# EAGLE design SimpleEMGCircuit (EAGLE 7.3.0)
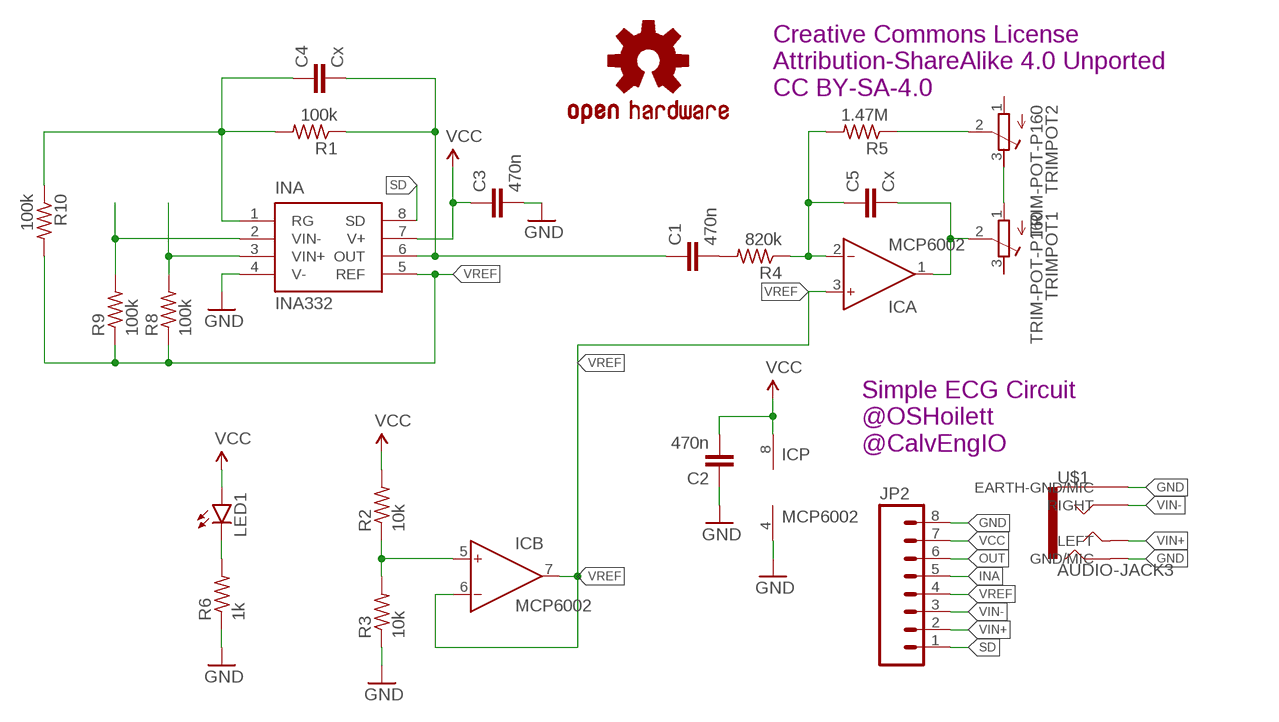
[diagram p0: schematic, sheet 1]

## Parts
C1  470n  C-EUC0402  [C0402]
C2  470n  C-EUC0402  [C0402]
C3  470n  C-EUC0402  [C0402]
C4  Cx  C-EUC0402  [C0402]
C5  Cx  C-EUC0402  [C0402]
IC  MCP6002  AD8607RM  [MSOP08]
INA  INA332  [MSOP08]
JP2  M08NO_SILK_FEMALE_PTH  [1X08_NO_SILK]
LED1  LED0603  [LED-0603]
LOGO1  OSHW-LOGOS  [OSHW-LOGO-S]
R1  100k  R-US_R0402  [R0402]
R2  10k  R-US_R0402  [R0402]
R3  10k  R-US_R0402  [R0402]
R4  820k  R-US_R0402  [R0402]
R5  1.47M  R-US_R0402  [R0402]
R6  1k  R-US_R0402  [R0402]
R8  100k  R-US_R0402  [R0402]
R9  100k  R-US_R0402  [R0402]
R10  100k  R-US_R0402  [R0402]
TRIMPOT1  TRIM-POT-P160  [16MMROTARYPOT]
TRIMPOT2  TRIM-POT-P160  [16MMROTARYPOT]
U$1  AUDIO-JACK3  [AUDIO-JACK-TRRS-SMD]

## Nets
GND: C2.1 C3.2 IC.4(P:V-) INA.4(V-) JP2.8 R3.1 R6.1 U$1.EARTH(EARTH-GND/MIC) U$1.RING2(GND/MIC)
INA: C1.1 C4.2 INA.6(OUT) JP2.5 R1.1
N$1: C4.1 INA.1(RG) R1.2 R10.1
N$2: TRIMPOT1.1(A) TRIMPOT2.3(E)
N$3: IC.5(B:IN+) R2.1 R3.2
N$4: C1.2 R4.2
N$5: C5.1 IC.2(A:IN-) R4.1 R5.2
N$6: LED1.C R6.2
N$14: R5.1 TRIMPOT2.2(S)
OUT: C5.2 IC.1(A:OUT) JP2.6 TRIMPOT1.2(S)
SD: INA.8(SD) JP2.1
VCC: C2.2 C3.1 IC.8(P:V+) INA.7(V+) JP2.7 LED1.A R2.2
VIN+: INA.3(VIN+) JP2.2 R8.2 U$1.TIP(LEFT)
VIN-: INA.2(VIN-) JP2.3 R9.2 U$1.RING1(RIGHT)
VREF: IC.3(A:IN+) IC.6(B:IN-) IC.7(B:OUT) INA.5(REF) JP2.4 R8.1 R9.1 R10.2
Unconnected: TRIMPOT1.3(E) TRIMPOT2.1(A)

## Notes on the sheet
- Creative Commons License
  Attribution-ShareAlike 4.0 Unported
  CC BY-SA-4.0
- Simple ECG Circuit
  @OSHoilett
  @CalvEngIO

## Library data of the parts
C1-C5 = resistor:C-EU: CAPACITOR, European symbol
IC = analog-devices:AD8607: Precision Micropower, Low Noise CMOS, Rail-to-Rail Input/Output Operational Amplifiers Source: http://www.analog.com/static/imported-files/data_sheets/AD8603_8607_8609.pdf; MF: ALTERA CORPORATION; MPN: AD8607ARMZ-REEL; OC_FARNELL: 1464990; OC_NEWARK: 59K6925
INA = Orlando:INA332
JP2 = SparkFun-Connectors:M08: Header 8 Standard 8-pin 0.1" header. Use with straight break away headers (SKU : PRT-00116), right angle break away headers (PRT-00553), swiss pins (PRT-00743), machine pins (PRT-00117), and female headers (PRT-00115).; PROD_ID: CONN-08438
LED1 = SparkFun-LED:LED: LEDs Standard schematic elements and footprints for 5mm, 3mm, 1206, and 0603 sized LEDs. 5mm - Spark Fun Electronics SKU : COM-00529 (and others)
LOGO1 = SparkFun-Aesthetics:OSHW-LOGO: Open Source Hardware Logo This logo indicates the piece of hardware it is found on incorporates a OSHW license and/or adheres to the definition of open source hardware found here: http://freedomdefined.org/OSHW
R1-R6 R8-R10 = resistor:R-US_: RESISTOR, American symbol
TRIMPOT1 TRIMPOT2 = Orlando:TRIM-POT-P160
U$1 = SparkFun-Connectors:AUDIO-JACK3: Audio jack - 3.5mm TRRS variety - two rings.

## Board
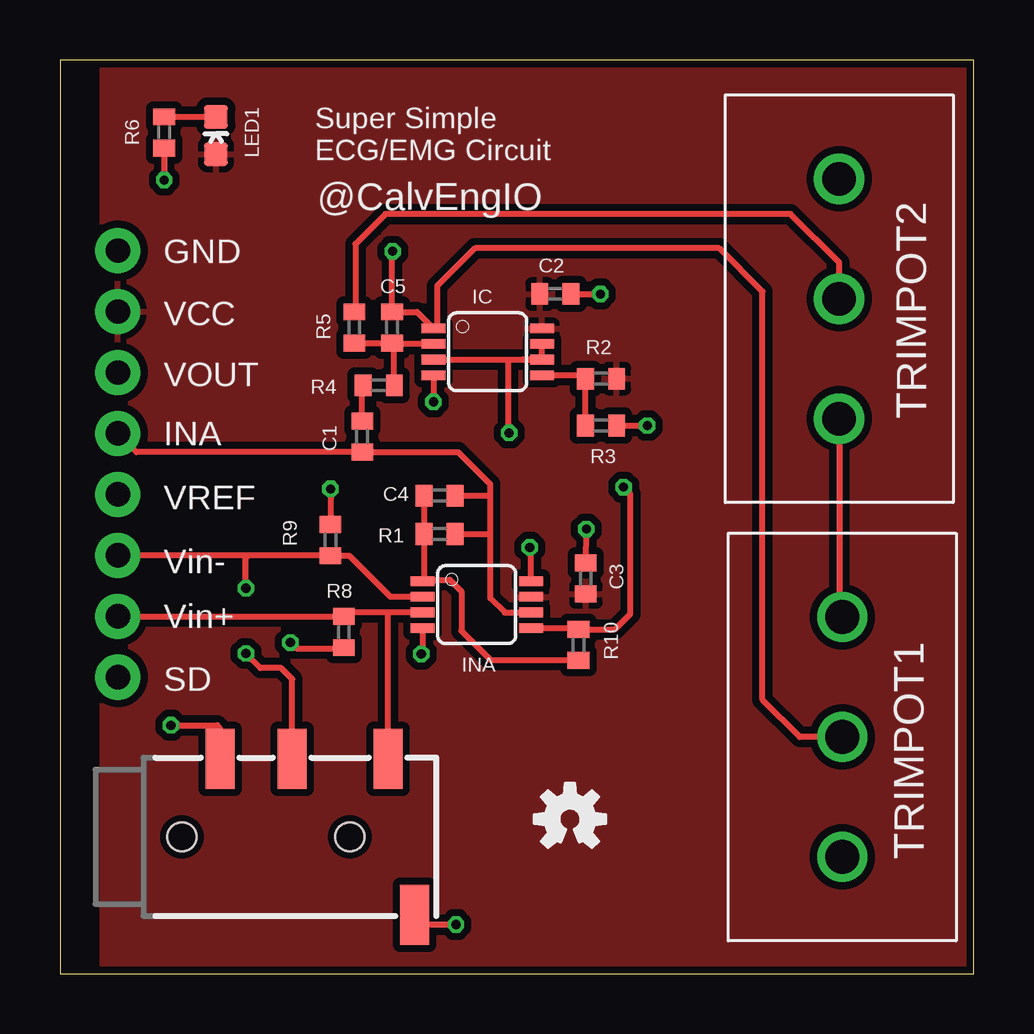
[diagram p1: board, top side]
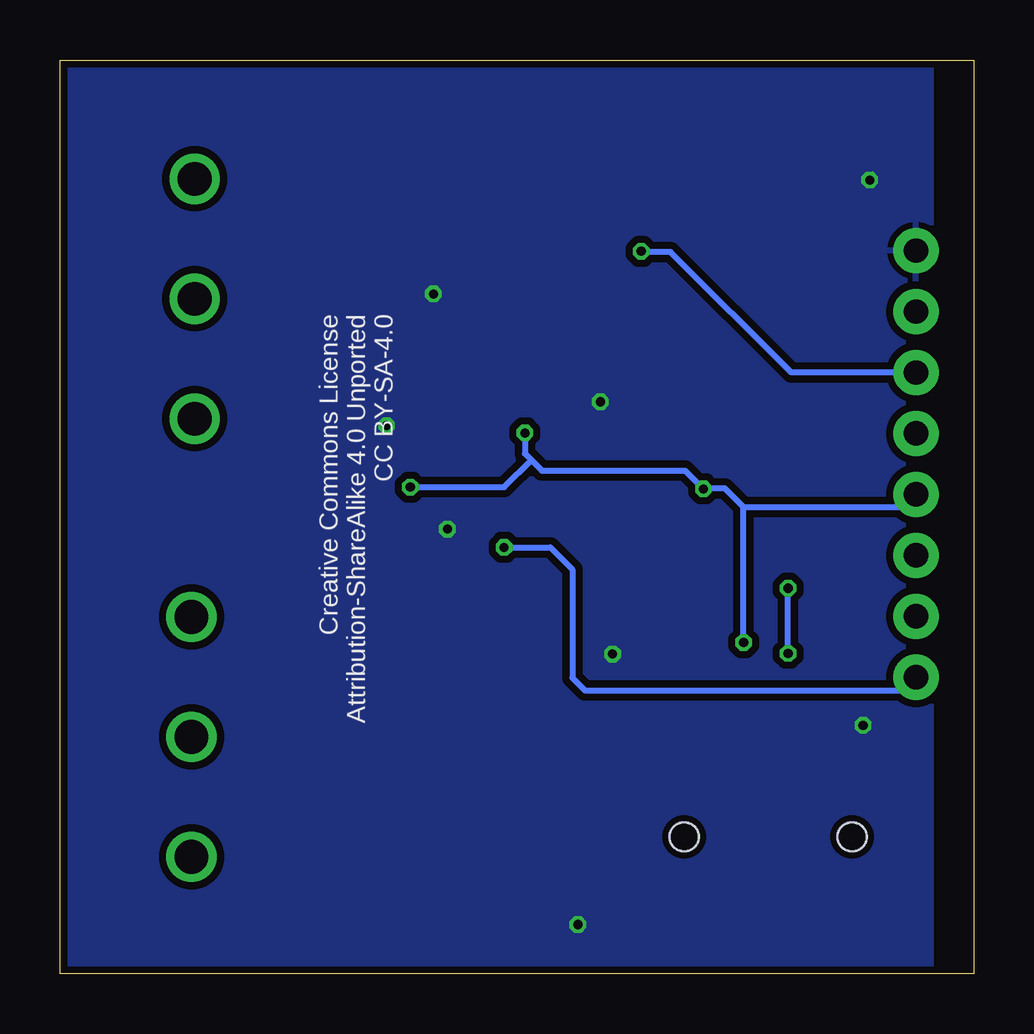
[diagram p2: board, bottom side, seen from below]

Size 38.1 x 38.1 mm. Coordinates in mm from the lower left corner, seen from the top.
Outline: 0,0 38.1,0 38.1,38.1 0,38.1 0,0
Copper layers (1*16): Top 0.035mm / dielectric 1.5mm / Bottom 0.035mm
Design rules "SeeedStudio_2layer_DRU_no_angle_20140221": minimum track width 6mil, minimum drill 12mil, track to track 6mil, track to pad 6mil, pad to pad 6mil, via to via 6mil, smd to smd 0mil, copper to edge 10mil, drill to drill 10mil, minimum pad ring 10mil, minimum via ring 6mil, stop-mask expansion 2mil, vias tented up to drill 100mil, thermal gap 10mil

### Footprints (pad centres in the part's own frame; a part is rotated, then mirrored left to right if it is on the bottom)
C0402 = smd 0.7 x 0.9: 1 -0.65,0; 2 0.65,0
MSOP08 = smd 0.4 x 1: 1 -0.976,-2.263; 2 -0.326,-2.263; 3 0.324,-2.263; 4 0.974,-2.263; 5 0.974,2.262; 6 0.324,2.262; 7 -0.326,2.262; 8 -0.976,2.262
1X08_NO_SILK = drill 1.016 pad 1.88: 1 0,0; 2 2.54,0; 3 5.08,0; 4 7.62,0; 5 10.16,0; 6 12.7,0; 7 15.24,0; 8 17.78,0
LED-0603 = smd 1 x 1: A 0,-0.677; C 0,0.877
R0402 = smd 0.7 x 0.9: 1 -0.65,0; 2 0.65,0
16MMROTARYPOT = drill 1.4: 1 -5,0; 2 0,0; 3 5,0
AUDIO-JACK-TRRS-SMD = smd 1.2 x 2.5: EARTH 11.3,-3.25; RING1 6.2,3.25; RING2 3.2,3.25; TIP 10.2,3.25 | hole 1.2: 1.6,0; 8.6,0

### Placement (x,y rotation side)
C1  12.6,22.4 90 top
C2  20.65,28.35 180 top
C3  21.92,16.48 90 top
C4  15.82,19.94 0 top
C5  13.84,26.95 90 top
IC  17.83,25.93 270 top
INA  17.37,15.39 270 top
JP2  2.41,12.37 90 top
LED1  6.5,34.85 0 top
LOGO1  21.26,6.45 0 top
R1  15.82,18.34 180 top
R2  22.56,24.82 0 top
R3  22.56,22.86 180 top
R4  13.28,24.54 180 top
R5  12.27,26.95 270 top
R6  4.34,35.08 90 top
R8  11.84,14.25 90 top
R9  11.28,18.08 270 top
R10  21.62,13.72 90 top
TRIMPOT1  32.61,9.88 270 top
TRIMPOT2  32.49,28.14 270 top
U$1  3.48,5.71 0 top

### Tracks (layer width: path | path; a pad name or v marks a point on that pad's centre or on a via)
GND  (via drill 0.38)
  Top 0.254: IC.4 v15.57,23.85 | C2.1 v22.53,28.35 | INA.4 15.11,13.38 v15.06,13.34 | R3.1 v24.49,22.86 | C3.2 21.95,18.49 v21.95,18.54 | v4.62,10.36 6.55,10.36 6.66,10.26 6.66,9.7 U$1.RING2 | v16.51,2.06 15.19,2.06 U$1.EARTH | R6.1 v4.34,33.1
  pour Bottom (isolate 0.305): 1.78,38.1 38.1,38.1 38.1,0 1.78,0
INA
  Top 0.254: 17.93,19.94 17.93,20.42 16.6,21.75 C1.1 3.19,21.75 JP2.5 | 17.93,19.94 17.93,18.34 | 17.93,18.34 17.93,15.67 18.54,15.06 INA.6 | C4.2 17.93,19.94 | R1.1 17.93,18.34
N$1
  Top 0.254: 15.17,16.43 R1.2 C4.1 | 15.17,16.43 INA.1 | 15.17,16.43 16.26,16.43 16.74,15.95 16.74,14.3 17.96,13.08 21.6,13.08 R10.1
N$2
  Top 0.254: TRIMPOT2.3 32.49,15.01 TRIMPOT1.1
N$3
  Top 0.254: IC.5 21.76,24.96 R2.1 | 21.89,24.8 R2.1 | R3.2 R2.1
N$4
  Top 0.254: C1.2 12.6,24.5 R4.2
N$5
  Top 0.254: IC.2 13.88,26.26 C5.1 | R4.1 13.93,26.21 C5.1 | R5.2 C5.1
N$6
  Top 0.254: R6.2 LED1.C
N$14
  Top 0.254: TRIMPOT2.2 32.49,29.64 30.45,31.67 13.56,31.67 12.32,30.43 12.32,27.65 R5.1
OUT  (via drill 0.38)
  Top 0.254: v13.87,30.12 13.84,30.1 C5.2 14.88,27.6 IC.1 15.72,27.06 15.72,28.68 17.3,30.25 27.48,30.25 29.29,28.45 29.29,11.43 30.84,9.88 TRIMPOT1.2
  Bottom 0.254: JP2.6 7.62,25.07 12.65,30.1 13.84,30.1 v13.87,30.12
SD  (via drill 0.38)
  Top 0.254: INA.8 19.64,17.73 v19.58,17.78
  Bottom 0.254: v19.58,17.78 17.65,17.78 16.74,16.87 16.74,12.34 16.2,11.81 2.97,11.81 JP2.1
VCC
  pour Top (isolate 0.305): 1.78,38.1 38.1,38.1 38.1,0 1.78,0
VIN+
  Top 0.254: JP2.2 11.83,14.91 R8.2 12.01,15.07 13.66,15.07 | INA.3 13.66,15.07 | U$1.TIP 13.68,15.05 13.66,15.07
VIN-  (via drill 0.38)
  Top 0.254: 7.85,17.45 11.26,17.45 R9.2 12.06,17.42 13.77,15.72 INA.2 | 7.85,17.45 JP2.3 | v7.75,13.36 8.36,12.75 9.22,12.75 9.68,12.29 U$1.RING1 | v7.75,16.08 7.75,17.35 7.85,17.45
  Bottom 0.254: v7.75,13.36 v7.75,16.08
VREF  (via drill 0.38)
  Top 0.254: IC.6 IC.7 | IC.6 19.26,25.61 | v18.72,22.55 18.67,22.61 18.67,25.53 18.75,25.61 | v11.28,20.22 R9.1 | v9.6,13.82 9.85,13.57 11.81,13.57 R8.1 | INA.5 21.56,14.42 R10.2 23.13,14.37 23.77,15.01 23.77,20.02 v23.5,20.3 | IC.3 18.75,25.61 | 18.75,25.61 IC.6
  Bottom 0.254: v18.72,22.55 18.72,21.69 18.45,21.43 | 18.45,21.43 18.01,20.98 12.04,20.98 v11.28,20.22 11.25,20.24 10.39,20.24 9.6,19.46 | v9.6,13.82 9.6,19.46 | v23.5,20.3 19.58,20.3 18.45,21.43 | 9.6,19.46 2.95,19.46 JP2.4

### Text on the board
tNames: Super Simple / ECG/EMG Circuit | @CalvEngIO | GND | VCC | VOUT | INA | VREF | Vin- | Vin+ | SD
_bsilk: Creative Commons License / Attribution-ShareAlike 4.0 Unported / CC BY-SA-4.0